# Altium schematic sheet channel.SchDoc
size A; SheetNumber: 2; SheetTotal: 2
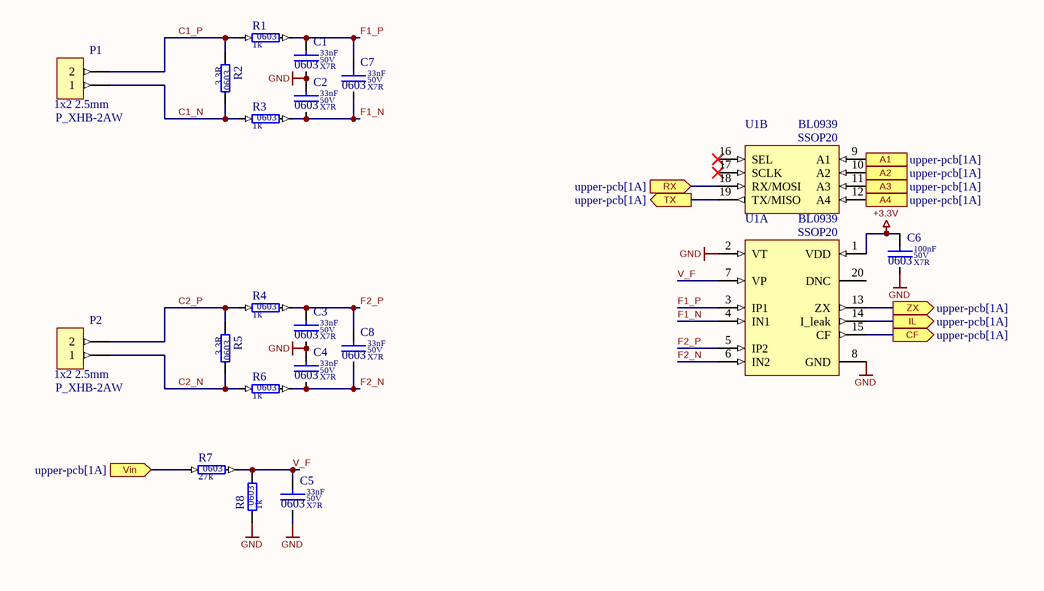
[diagram p0: channel.SchDoc]

## Parts
C1  value 33nF  Dielectric: X7R  Voltage: 50V  SCH_Footprint: 0603  [C_0603_1608]  (hidden comment: Ceramic X7R)
C2  value 33nF  Dielectric: X7R  Voltage: 50V  SCH_Footprint: 0603  [C_0603_1608]  (hidden comment: Ceramic X7R)
C3  value 33nF  Dielectric: X7R  Voltage: 50V  SCH_Footprint: 0603  [C_0603_1608]  (hidden comment: Ceramic X7R)
C4  value 33nF  Dielectric: X7R  Voltage: 50V  SCH_Footprint: 0603  [C_0603_1608]  (hidden comment: Ceramic X7R)
C5  value 33nF  Dielectric: X7R  Voltage: 50V  SCH_Footprint: 0603  [C_0603_1608]  (hidden comment: Ceramic X7R)
C6  value 100nF  Dielectric: X7R  Voltage: 50V  SCH_Footprint: 0603  [C_0603_1608]  (hidden comment: Ceramic X7R)
C7  value 33nF  Dielectric: X7R  Voltage: 50V  SCH_Footprint: 0603  [C_0603_1608]  (hidden comment: Ceramic X7R)
C8  value 33nF  Dielectric: X7R  Voltage: 50V  SCH_Footprint: 0603  [C_0603_1608]  (hidden comment: Ceramic X7R)
P1  value P_XHB-2AW  SCH_Footprint: 1x2 2.5mm  [P_XHB-2AW]  (hidden comment: XHB)
P2  value P_XHB-2AW  SCH_Footprint: 1x2 2.5mm  [P_XHB-2AW]  (hidden comment: XHB)
R1  value 1k  SCH_Footprint: 0603  [R_0603_1608]  (hidden comment: Resistor)
R2  value 3.3R  SCH_Footprint: 0603  [R_0603_1608]  (hidden comment: Resistor)
R3  value 1k  SCH_Footprint: 0603  [R_0603_1608]  (hidden comment: Resistor)
R4  value 1k  SCH_Footprint: 0603  [R_0603_1608]  (hidden comment: Resistor)
R5  value 3.3R  SCH_Footprint: 0603  [R_0603_1608]  (hidden comment: Resistor)
R6  value 1k  SCH_Footprint: 0603  [R_0603_1608]  (hidden comment: Resistor)
R7  value 27k  SCH_Footprint: 0603  [R_0603_1608]  (hidden comment: Resistor)
R8  value 1k  SCH_Footprint: 0603  [R_0603_1608]  (hidden comment: Resistor)
U1  value BL0939  SCH_Footprint: SSOP20  [SSOP20_3.9x8.65]  (hidden comment: Electrical mains 2-ch power meter)  (parts A,B of 2)

## Ports
A1 (in, see upper-pcb[1A]), A2 (in, see upper-pcb[1A]), A3 (in, see upper-pcb[1A]), A4 (in, see upper-pcb[1A]), CF (out, see upper-pcb[1A]), IL (out, see upper-pcb[1A]), RX (in, see upper-pcb[1A]), TX (out, see upper-pcb[1A]), Vin (in, see upper-pcb[1A]), ZX (out, see upper-pcb[1A])

## Nets
+3.3V: C6.1 U1.1(VDD)
GND: C1.2 C2.1 C3.2 C4.1 C5.2 C6.2 R8.1 U1.2(VT) U1.8(GND)
A1: U1.9(A1) ; port A1
A2: U1.10(A2) ; port A2
A3: U1.11(A3) ; port A3
A4: U1.12(A4) ; port A4
C1_N: P1.1 R2.2 R3.1
C1_P: P1.2 R1.1 R2.1
C2_N: P2.1 R5.2 R6.1
C2_P: P2.2 R4.1 R5.1
CF: U1.15(CF) ; port CF
F1_N: C2.2 C7.2 R3.2 U1.4(IN1)
F1_P: C1.1 C7.1 R1.2 U1.3(IP1)
F2_N: C4.2 C8.2 R6.2 U1.6(IN2)
F2_P: C3.1 C8.1 R4.2 U1.5(IP2)
IL: U1.14(I_leak) ; port IL
RX: U1.18(RX/MOSI) ; port RX
TX: U1.19(TX/MISO) ; port TX
V_F: C5.1 R7.2 R8.2 U1.7(VP)
Vin: R7.1 ; port Vin
ZX: U1.13(ZX) ; port ZX

Not connected (* = marked no-connect by the designer): U1 16(SEL)* 17(SCLK)* 20(DNC)

## Library data of the parts
C1-C5 C7 C8 = C_33nF_50V_X7R_0603_10: Capacitor; Manufacturer: Yageo; Manufacturer Part Number: CC0603KRX7R9BB333; Tolerance (%): 10; Part Number: C_33nF_50V_X7R_0603_10; HelpURL: https://datasheet.octopart.com/CC0603KRX7R9BB333-Yageo-datasheet-10883670.pdf; Supplier 1: TME; Supplier 2: RS Components; Supplier 3: Farnell; Supplier 4: Mouser; Supplier 5: Digi-Key; Supplier 6: LCSC
C6 = C_100nF_50V_X7R_0603_5: Capacitor; Manufacturer: Samsung; Manufacturer Part Number: CL10B104JB8NNNC; Tolerance (%): 5; Part Number: C_100nF_50V_X7R_0603_5; HelpURL: http://www.tme.eu/pl/Document/4a42202b32dab16128fe107dd69598cc/samsung-chip-cap.pdf; Supplier 1: TME; Supplier Part Number 1: CL10B104JB8NNNC; Supplier 2: RS Components; Supplier Part Number 2: 7665455; Supplier 3: Farnell; Supplier 4: Mouser; Supplier 5: Digi-Key; Supplier Part Number 5: 1276-1033-1-ND; Supplier 6: LCSC; Supplier Part Number 6: C24452
P1 P2 = P_XHB-2AW: Pin Header; Part Number: P_XHB-2AW; HelpURL: https://datasheet.lcsc.com/lcsc/2307111607_HCTL-HC-XHB-2AW_C3011964.pdf; Manufacturer: -; Manufacturer Part Number: P_XHB-2AW; Supplier 1: TME; Supplier 2: RS Components; Supplier 3: Farnell; Supplier 4: Mouser; Supplier 5: Digi-Key; Supplier 6: LCSC; Supplier Part Number 6: C248901; Supplier 7: JLCPCB; Supplier Part Number 7: C3011964
R1 R3 R4 R6 R8 = R_1k_0603_1: Manufacturer: Vishay; Manufacturer Part Number: CRCW06031K00FKEA; Voltage: 75V; Power: 100mW; Tolerance: 1%; Part Number: R_1k_0603_1; HelpURL: http://www.farnell.com/datasheets/2310790.pdf?_ga=2.256888843.1690599162.1548417389-1379097396.1542296996&_gac=1.262631934.1547230258.Cj0KCQiAmuHhBRD0ARIsAFWyPwhX8HcvXnM3tA0ZBodZLzDIjH2ZxLpjT5LWo9bad_HPRbU8LfPq44UaAhEwEALw_wcB; Supplier 1: TME; Supplier 2: RS Components; Supplier Part Number 2: 678-9875P; Supplier 3: Farnell; Supplier Part Number 3: 1469740; Supplier 4: Mouser; Supplier Part Number 4: 71-CRCW0603-1.0K-E3; Supplier 5: Digi-Key; Supplier Part Number 5: 541-1.00KHCT-ND; Supplier 6: LCSC
R2 R5 = R_3.3R_0603_5: Manufacturer: Yageo; Manufacturer Part Number: RC0603JR-073R3L; Voltage: 50V; Power: 100mW; Tolerance: 5%; Part Number: R_3.3R_0603_5; HelpURL: https://datasheet.octopart.com/RC0603JR-073R3L-Yageo-datasheet-8328172.pdf; Supplier 1: TME; Supplier Part Number 1: RC0603JR-073R3; Supplier 2: RS Components; Supplier 3: Farnell; Supplier 4: Mouser; Supplier Part Number 4: 603-RC0603JR-073R3L; Supplier 5: Digi-Key; Supplier Part Number 5: 311-3.3GRCT-ND; Supplier 6: LCSC
R7 = R_27k_0603_1: Manufacturer: Vishay; Manufacturer Part Number: CRCW060327K0FKEA; Voltage: 75V; Power: 100mW; Tolerance: 1%; Part Number: R_27k_0603_1; HelpURL: http://www.farnell.com/datasheets/2310790.pdf?_ga=2.12382260.1690599162.1548417389-1379097396.1542296996&_gac=1.51852635.1547230258.Cj0KCQiAmuHhBRD0ARIsAFWyPwhX8HcvXnM3tA0ZBodZLzDIjH2ZxLpjT5LWo9bad_HPRbU8LfPq44UaAhEwEALw_wcB; Supplier 1: TME; Supplier 2: RS Components; Supplier Part Number 2: 679-0087; Supplier 3: Farnell; Supplier Part Number 3: 1652864; Supplier 4: Mouser; Supplier Part Number 4: 71-CRCW0603-27K-E3; Supplier 5: Digi-Key; Supplier Part Number 5: 541-27.0KHCT-ND; Supplier 6: LCSC
U1 = U_BL0939: Manufacturer: Belling; Part Number: U_BL0939; HelpURL: https://www.belling.com.cn/media/file_object/bel_product/BL0939/datasheet/BL0939_V1.2_cn.pdf; Manufacturer Part Number: BL0939; Supplier 1: TME; Supplier 2: RS Components; Supplier 3: Farnell; Supplier 4: Mouser; Supplier 5: Digi-Key; Supplier 6: LCSC; Supplier Part Number 6: C2841044; Supplier 7: Aliexpress; Supplier Part Number 7: BL0939